# EasyEDA Pro project TargetV1.eprj

# Schematic Schematic1
Create Date: 2022-10-10; Page Name: P1; Project Name: TargetV1; Schematic Name: Schematic1; Update Date: 2023-03-28
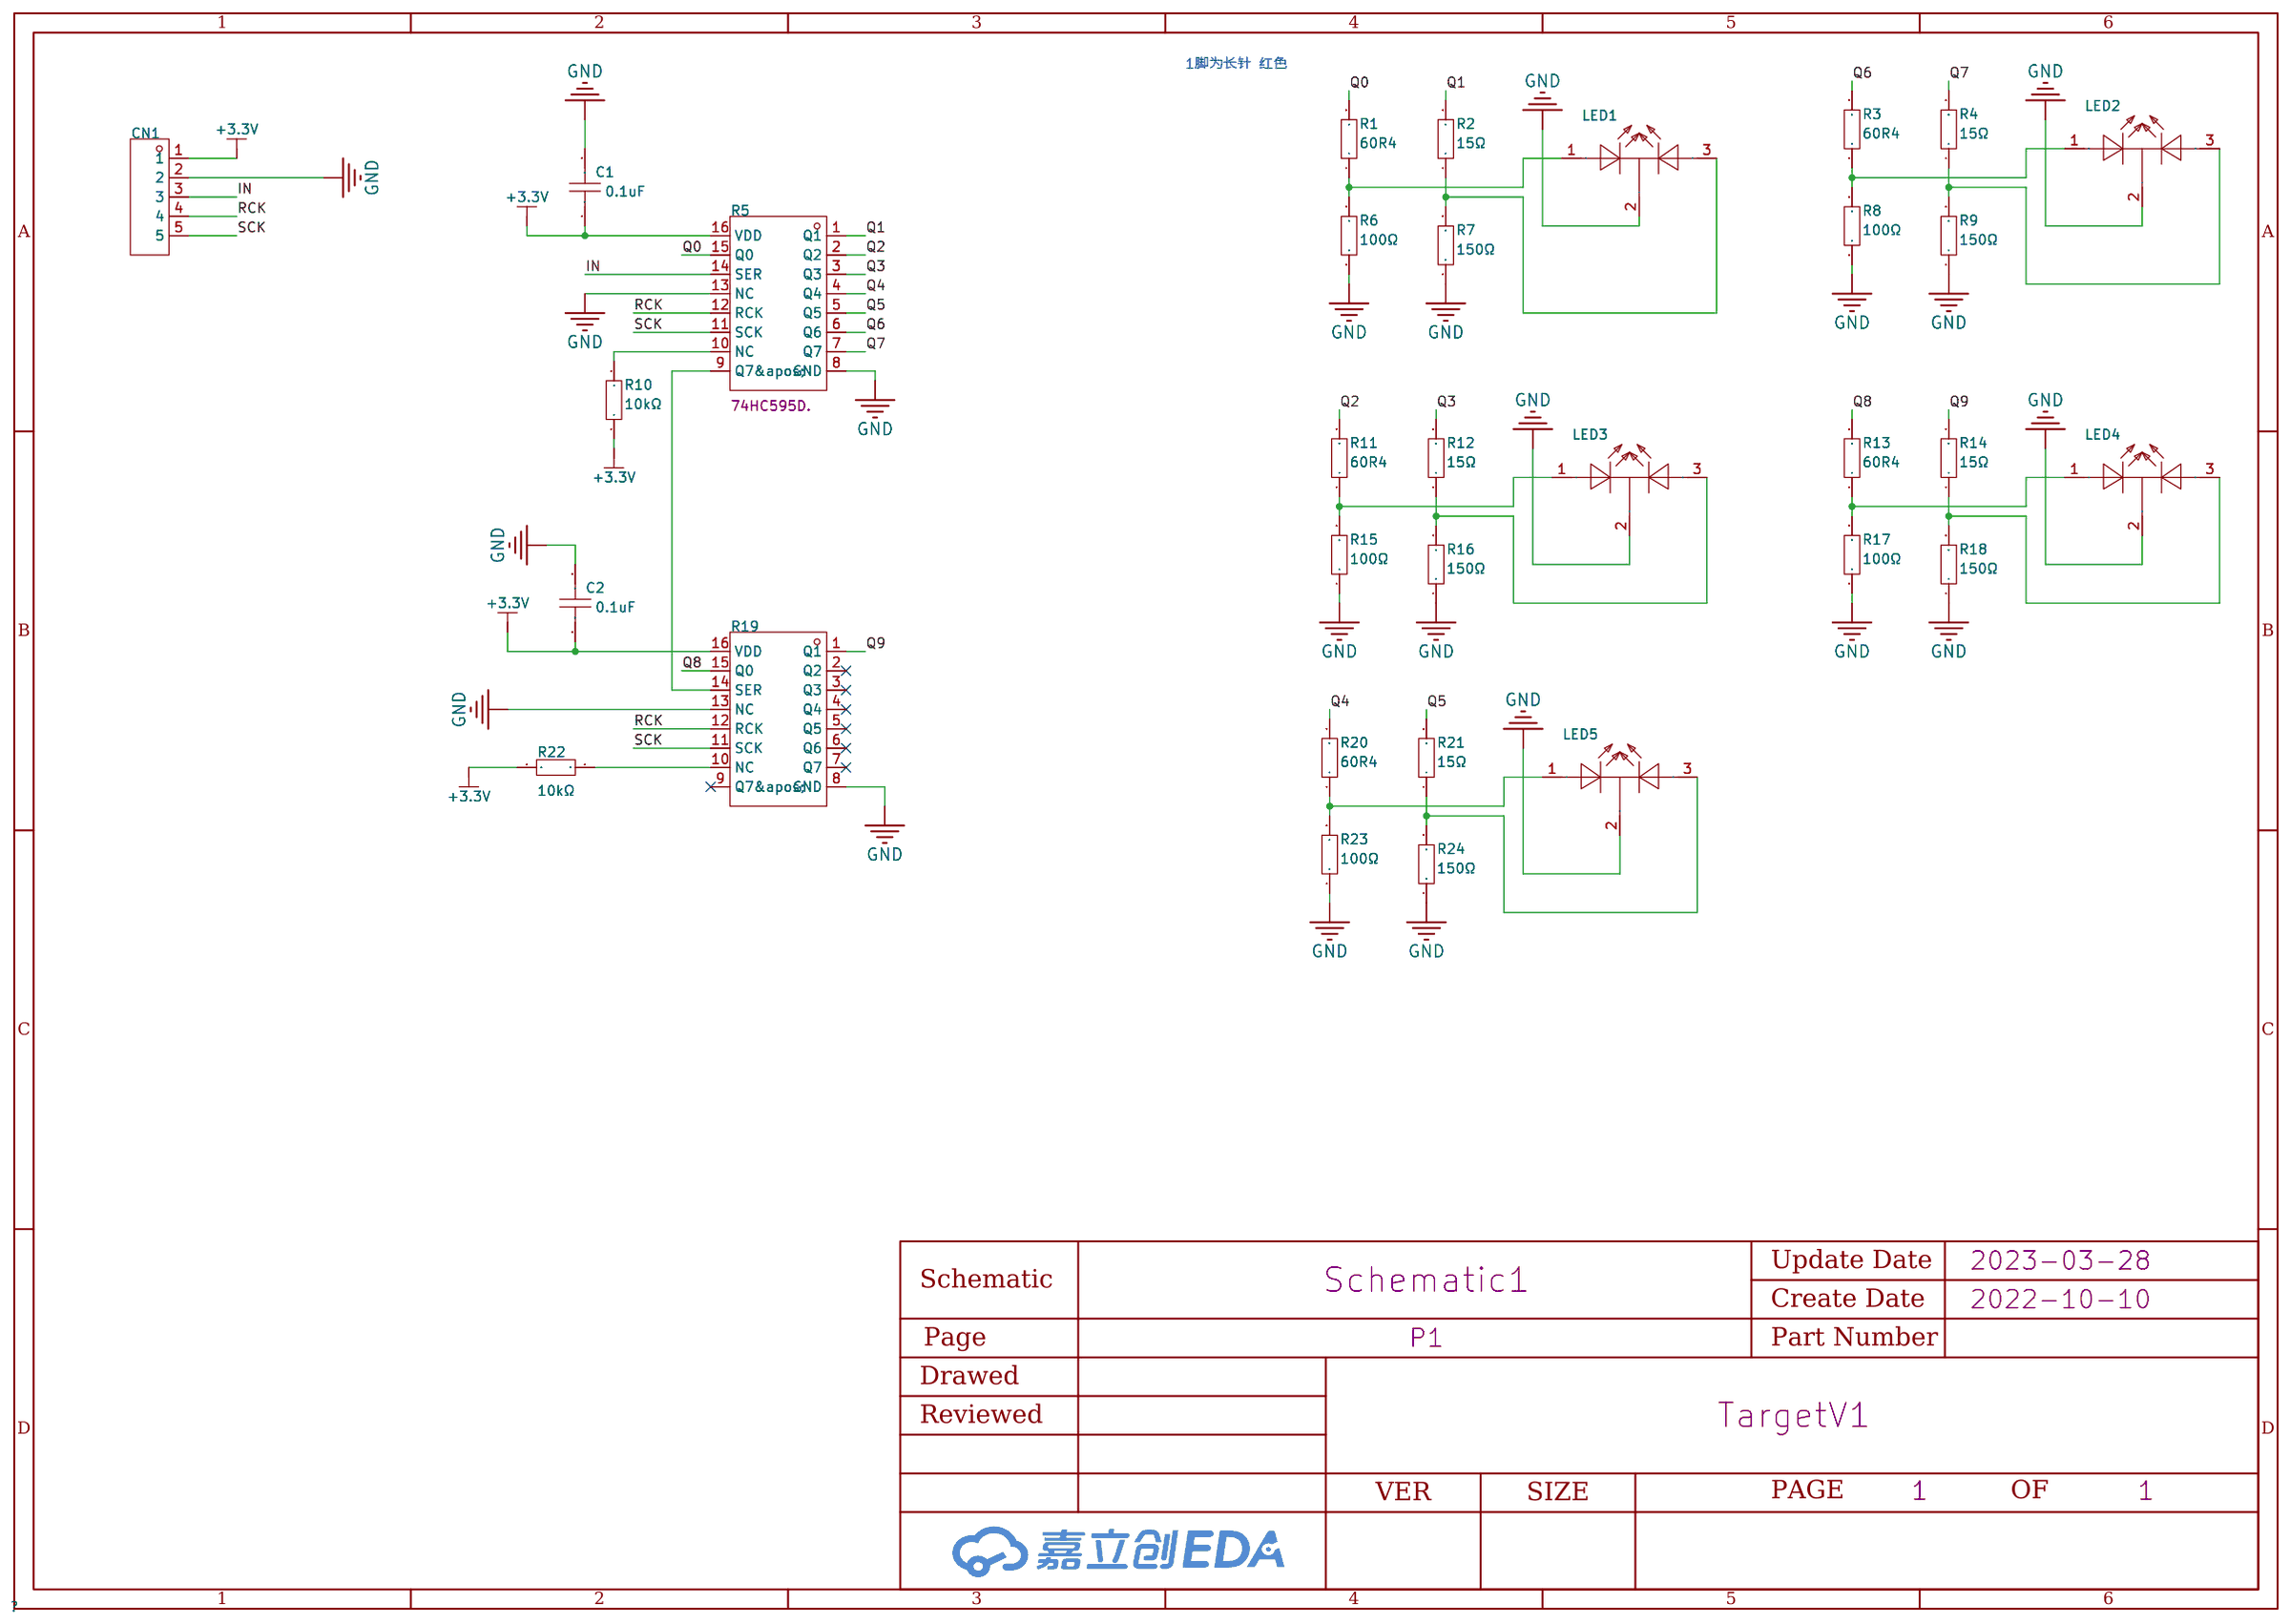
[diagram p0: schematic sheet]

## Parts
C1  0.1uF  [C0603]
C2  0.1uF  [C0603]
CN1  HX25003-5A  [CONN-TH_5P-P2.50_HX25003-5A]
LED1  MHLC5019UEGTD  [LED-TH_3P-BD5.9-P2.54-BI]
LED2  MHLC5019UEGTD  [LED-TH_3P-BD5.9-P2.54-BI]
LED3  MHLC5019UEGTD  [LED-TH_3P-BD5.9-P2.54-BI]
LED4  MHLC5019UEGTD  [LED-TH_3P-BD5.9-P2.54-BI]
LED5  MHLC5019UEGTD  [LED-TH_3P-BD5.9-P2.54-BI]
R1  60R4  [R0603]
R2  15Ω  [R0603]
R3  60R4  [R0603]
R4  15Ω  [R0603]
R5  74HC595D.  [SOP-16_L9.9-W3.9-P1.27-LS6.0-BL]
R6  100Ω  [R0603]
R7  150Ω  [R0603]
R8  100Ω  [R0603]
R9  150Ω  [R0603]
R10  10kΩ  [R0603]
R11  60R4  [R0603]
R12  15Ω  [R0603]
R13  60R4  [R0603]
R14  15Ω  [R0603]
R15  100Ω  [R0603]
R16  150Ω  [R0603]
R17  100Ω  [R0603]
R18  150Ω  [R0603]
R19  74HC595D.  [SOP-16_L9.9-W3.9-P1.27-LS6.0-BL]
R20  60R4  [R0603]
R21  15Ω  [R0603]
R22  10kΩ  [R0603]
R23  100Ω  [R0603]
R24  150Ω  [R0603]

## Library data of the parts
C1 C2 = CC0603KRX7R9BB104: 容值:100nF;精度:±10%;额定电压:50V;材质(温度系数):X7R;; LCSC Part Name: 100nF ±10% 50V; Supplier Part: C14663; Manufacturer: YAGEO(国巨); Supplier Footprint: 0603; JLCPCB Part Class: Basic Part; Datasheet: https://atta.szlcsc.com/upload/public/pdf/source/20170116/1484561234239.pdf; Supplier: LCSC; Tolerance: ±10%; Voltage Rated: 50V; Temperature Coefficient: X7R
CN1 = HX25003-5A: 参考系列:XH;间距:2.5mm;插针结构:1x5P;排数:1;每排PIN数:5;行距:-;公母:公型插针;安装方式:直插;额定电流:-;工作温度范围:-;; LCSC Part Name: XH 2.5mm 1x5P 直插; Supplier Part: C442302; Manufacturer: HX(红星); Supplier Footprint: 插件,P=2.5mm; JLCPCB Part Class: Extended Part; Datasheet: https://atta.szlcsc.com/upload/public/pdf/source/20191028/C442302_E66AD84792E19526D7353D56EEE1C29F.pdf; Supplier: LCSC; Reference Series: XH; Pitch: 2.5mm; Pins Structure: 1x5P; Number of Rows: 1; Number of PINs Per Row: 5; Gender: 公型插针; Mounting Style: 直插
LED1-LED5 = MHLC5019UEGTD: 发光颜色:红灯,翠绿;二极管配置:共阴极;透镜颜色:雾状白;主波长:525nm；622nm;峰值波长:530nm；632nm;色温:-;测试电流:20mA;功率:80mW；120mW;发光角度:120°;安装方式:-;工作温度:-25~+85;; LCSC Part Name: 红灯,翠绿 共阴极 525nm 622nm; Supplier Part: C473816; Manufacturer: MEIHUA(美华); Supplier Footprint: 直插,P=2.54mm; JLCPCB Part Class: Extended Part; Datasheet: https://atta.szlcsc.com/upload/public/pdf/source/20191226/C473816_FEA15EBA9D37F3DD249283AD8272677B.pdf; Supplier: LCSC; Emitted Color: 红灯,翠绿; Diode Configuration: 共阴极; Lens Color: 雾状白; Dominant Wavelength: 525nm；622nm; Peak Wavelength: 530nm；632nm; Forward Current: 20mA; Power Dissipation: 80mW；120mW; Viewing Angle: 120°; Operating Temperature: -25~+85; Lamp Holder Type: 5mm圆形灯头
R1-R4 R6-R18 R20-R24 = 0603WAF1002T5E: 电阻类型:厚膜电阻;阻值:10kΩ;精度:±1%;功率:100mW;温度系数:±100ppm/;最大工作电压:75V;工作温度范围:-55~+155;; LCSC Part Name: 10kΩ ±1% 100mW; Supplier Part: C25804; Manufacturer: UNI-ROYAL(厚声); Supplier Footprint: 0603; JLCPCB Part Class: Basic Part; Datasheet: https://atta.szlcsc.com/upload/public/pdf/source/20200306/C422600_1E6D84923E4A46A82E41ADD87F860B5C.pdf; Supplier: LCSC; Type: 厚膜电阻; Tolerance: ±1%; Power(Watts): 100mW; Temperature Coefficient: ±100ppm/; Overload Voltage (Max): 75V; Operating Temperature Range: -55~+155
R5 R19 = 74HC595D.: Supplier Part: C2929943; Manufacturer: FM(富满); Supplier Footprint: SOP-16; JLCPCB Part Class: Extended Part; Datasheet: https://atta.szlcsc.com/upload/public/pdf/source/20211125/20F1E3849D7C8A7DB346B0C433D530E9.pdf; Supplier: LCSC

## Nets
+3.3V: C1.1 C2.1 CN1.1 R5.16(VDD) R10.1 R19.16(VDD) R22.2
GND: C1.2 C2.2 CN1.2 LED1.2(-) LED2.2(-) LED3.2(-) LED4.2(-) LED5.2(-) R5.8(GND) R5.13(NC) R6.1 R7.1 R8.1 R9.1 R15.1 R16.1 R17.1 R18.1 R19.8(GND) R19.13(NC) R23.1 R24.1
IN: CN1.3 R5.14(SER)
Q0: R1.2 R5.15(Q0)
Q1: R2.2 R5.1(Q1)
Q2: R5.2(Q2) R11.2
Q3: R5.3(Q3) R12.2
Q4: R5.4(Q4) R20.2
Q5: R5.5(Q5) R21.2
Q6: R3.2 R5.6(Q6)
Q7: R4.2 R5.7(Q7)
Q8: R13.2 R19.15(Q0)
Q9: R14.2 R19.1(Q1)
RCK: CN1.4 R5.12(RCK) R19.12(RCK)
SCK: CN1.5 R5.11(SCK) R19.11(SCK)
$1N1102: R5.10(NC) R10.2
$1N1166: R5.9(Q7&apos;) R19.14(SER)
$1N1771: R19.10(NC) R22.1
$1N5350: LED1.1(+) R1.1 R6.2
$1N5516: LED1.3(+) R2.1 R7.2
$1N6308: LED3.1(+) R11.1 R15.2
$1N6309: LED3.3(+) R12.1 R16.2
$1N6730: LED5.1(+) R20.1 R23.2
$1N6731: LED5.3(+) R21.1 R24.2
$1N7312: LED2.1(+) R3.1 R8.2
$1N7313: LED2.3(+) R4.1 R9.2
$1N7752: LED4.1(+) R13.1 R17.2
$1N7753: LED4.3(+) R14.1 R18.2

Not connected (* = marked no-connect by the designer): R19 2(Q2)* 3(Q3)* 4(Q4)* 5(Q5)* 6(Q6)* 7(Q7)* 9(Q7&apos;)*

## Notes on the sheet
- 1脚为长针 红色

# Board PCB3
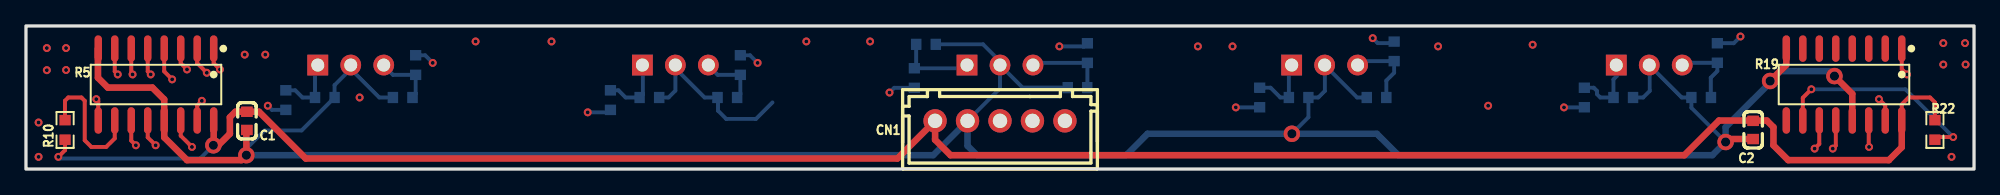
[diagram p1: board, top side]
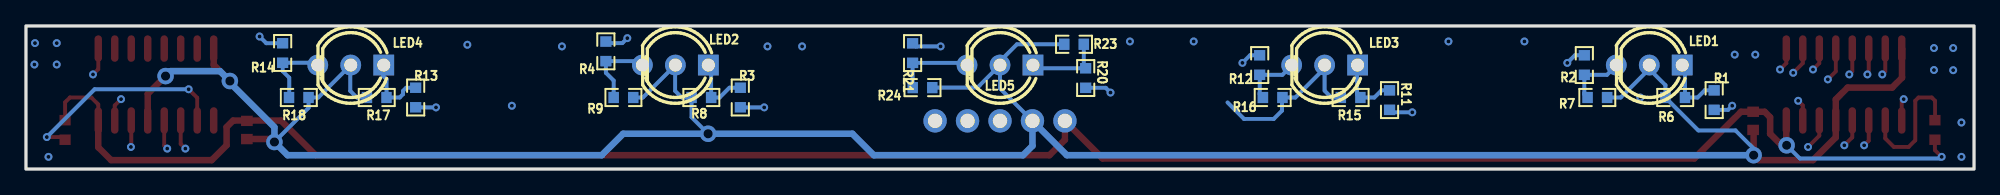
[diagram p2: board, bottom side, seen from below]

Outline 150.02 x 11.02 mm; copper layers: Top Layer, CPU1, CPU2, Bottom Layer. Coordinates in mm from the lower left corner of the outline.
Outline path: rectangle 0,11.02 150.02,0
Stack: Top Layer 0.035mm / Dielectric1 0.48mm PP er 4.5 / CPU1 0.035mm / Dielectric2 0.48mm FR4 er 4.5 / CPU2 0.035mm / Dielectric3 0.48mm PP er 4.5 / Bottom Layer 0.035mm

## Design rules (mm)
spacing safeClearance (default): track to track 0.152, other pairs 0.152 to 0.3
track width trackWidth (default): min 0.127, default 0.254, max 2.54
differential pair differentialPair (default): width min 0.127, default 0.254, max 2.54; gap min 0.152, default 0.152
via viaSize (default): diameter min 0.5, default 0.61, max 10; hole min 0.3, default 0.305, max 6

## Placement (name value [footprint] x y rotation side)
C1  0.1uF  [C0603]  17.01 3.71 270 top
C2  0.1uF  [C0603]  133.01 3.01 270 top
CN1  HX25003-5A  [CONN-TH_5P-P2.50_HX25003-5A]  75.01 3.71 0 top
LED1  MHLC5019UEGTD  [LED-TH_3P-BD5.9-P2.54-BI]  25.01 8.01 0 bottom
LED2  MHLC5019UEGTD  [LED-TH_3P-BD5.9-P2.54-BI]  100.01 8.01 0 bottom
LED3  MHLC5019UEGTD  [LED-TH_3P-BD5.9-P2.54-BI]  50.01 8.01 0 bottom
LED4  MHLC5019UEGTD  [LED-TH_3P-BD5.9-P2.54-BI]  125.01 8.01 0 bottom
LED5  MHLC5019UEGTD  [LED-TH_3P-BD5.9-P2.54-BI]  75.01 8.01 0 bottom
R1  60R4  [R0603]  20.01 5.31 270 bottom
R2  15Ω  [R0603]  30.01 8.01 90 bottom
R3  60R4  [R0603]  95.01 5.51 270 bottom
R4  15Ω  [R0603]  105.37 9.07 90 bottom
R5  74HC595D.  [SOP-16_L9.9-W3.9-P1.27-LS6.0-BL]  10.01 6.51 180 top
R6  100Ω  [R0603]  23.01 5.51 180 bottom
R7  150Ω  [R0603]  29.01 5.51 0 bottom
R8  100Ω  [R0603]  98.01 5.51 180 bottom
R9  150Ω  [R0603]  104.01 5.51 0 bottom
R10  10kΩ  [R0603]  3.01 3.01 90 top
R11  60R4  [R0603]  45.01 5.31 270 bottom
R12  15Ω  [R0603]  55.01 8.01 90 bottom
R13  60R4  [R0603]  120.01 5.51 270 bottom
R14  15Ω  [R0603]  130.26 8.94 90 bottom
R15  100Ω  [R0603]  48.01 5.51 180 bottom
R16  150Ω  [R0603]  54.01 5.51 0 bottom
R17  100Ω  [R0603]  123.01 5.51 180 bottom
R18  150Ω  [R0603]  129.01 5.51 0 bottom
R19  74HC595D.  [SOP-16_L9.9-W3.9-P1.27-LS6.0-BL]  140.01 6.51 180 top
R20  60R4  [R0603]  68.41 7.01 270 bottom
R21  15Ω  [R0603]  81.74 8.93 90 bottom
R22  10kΩ  [R0603]  147.01 3.01 90 top
R23  100Ω  [R0603]  69.31 9.61 180 bottom
R24  150Ω  [R0603]  80.98 6.27 0 bottom

## Footprints (pads in the part's own frame, mm; a bottom-side part is the same pattern mirrored in y, then rotated)
C0603
  rect 0.8x0.9 smd: 1(-0.7,0) 2(0.7,0)
CONN-TH_5P-P2.50_HX25003-5A
  round 1.8 hole 1.1: 1(-5,0) 2(-2.5,0) 3(0,0) 4(2.5,0) 5(5,0)
LED-TH_3P-BD5.9-P2.54-BI
  rect 1.6x1.6 hole 1: 1(-2.54,0)
  round 1.6 hole 1: 2(0,0) 3(2.54,0)
R0603
  rect 0.806x0.864 smd: 1(-0.753,0) 2(0.753,0)
SOP-16_L9.9-W3.9-P1.27-LS6.0-BL
  oval 0.574x2.038 smd: 1(-4.445,-2.769) 2(-3.175,-2.769) 3(-1.905,-2.769) 4(-0.635,-2.769) 5(0.635,-2.769) 6(1.905,-2.769) 7(3.175,-2.769) 8(4.445,-2.769) 9(4.445,2.769) 10(3.175,2.769) 11(1.905,2.769) 12(0.635,2.769) 13(-0.635,2.769) 14(-1.905,2.769) 15(-3.175,2.769) 16(-4.445,2.769)

## Nets
As in the schematic.

Pads without a net: R19 2 3 4 5 6 7 9

## Via types
v1: diameter 0.61, hole 0.305, Top Layer to Bottom Layer, 53 vias
v2: diameter 1.27, hole 0.711, Top Layer to Bottom Layer, 5 vias
v3: diameter 1.27, hole 0.7, Top Layer to Bottom Layer, 1 via

## Routing (per net, layer and track width the routed paths; a pad name or vN(x,y) marks a point on that pad's centre or on a via; arc(x,y) is an arc through that point)
+3.3V: length 163.6
  Top Layer w0.3: v1(2.5,0.94) 3.01,1.46 R10.1 ; R19.16 144.46,4.98 144.99,5.51 146.64,5.51 147.01,5.14 R22.2
  Top Layer w0.5: R5.16 14.46,1.85 v3(14.43,1.83) 14.81,1.83 15.7,2.72 15.7,3.99 16.13,4.41 C1.1 17.95,4.41 21.55,0.81 67.11,0.81 CN1.1 70.01,2.26 71.2,1.07 127.72,1.07 130.38,3.73 132.99,3.73 C2.1 133.03,3.73 134.07,3.73 134.57,3.23 134.57,1.83 135.72,0.69 143.47,0.69 144.46,1.68 R19.16
  Bottom Layer w0.3: v1(2.5,0.94) 2.62,0.81 13.42,0.81 v3(14.43,1.83)
GND: length 230
  Top Layer w0.5: R19.13 140.65,5.79 v2(139.27,7.16) ; C1.2 16.97,2.97 v2(16.97,1.07) 16.59,0.69 12.4,0.69 10.65,2.44 R5.13 10.65,5.36 9.73,6.27 6.31,6.27 5.54,7.04 5.54,9.26 R5.8 ; R19.8 135.57,8.03 v2(134.32,6.78) ; v2(130.89,2.08) 131.12,2.31 C2.2
  Bottom Layer w0.3: 100.03,7.99 100.03,6.02 99.52,5.51 R8.1 98.77,3.99 v2(97.49,2.72) ; 100.03,7.99 LED2.2 ; 100.03,7.99 102.51,5.51 R9.1 ; R7.1 27.21,5.51 25.01,7.71 ; 50.01,7.76 50.01,6.04 49.48,5.51 R15.1 ; 50.01,7.76 52.26,5.51 R16.1 53.29,5.48 53.29,4.5 53.93,3.86 56.22,3.86 57.49,5.13 ; 50.01,7.76 LED3.2 ; LED5.2 76.75,6.27 R24.1 ; LED5.2 75.01,6.21 CN1.2 ; LED5.2 75.01,8.31 73.71,9.61 R23.1 ; 125.05,7.97 127.51,5.51 R18.1 128.26,4.72 v2(130.89,2.08) ; 125.05,7.97 LED4.2 ; 125.05,7.97 125.05,6.02 124.54,5.51 R17.1 ; 25.01,7.71 LED1.2 ; 25.01,7.71 23.77,6.46 R6.1 21.23,2.97 18.37,2.97 16.97,1.58 v2(16.97,1.07)
  Bottom Layer w0.5: v2(139.27,7.16) 138.89,7.54 135.08,7.54 v2(134.32,6.78) 134.32,6.66 130.89,3.23 v2(130.89,2.08) 129.88,1.07 105.68,1.07 104.03,2.72 v2(97.49,2.72) 86.38,2.72 84.73,1.07 73.23,1.07 72.51,1.79 CN1.2 69.87,1.07 v2(16.97,1.07)
  vias: v1(0.97,3.59) v1(0.97,0.94) v1(1.61,9.32) v1(1.61,7.62) v1(3.09,9.32) v1(3.09,7.63) v1(16.85,8.81) v1(18.43,8.81) v1(25.7,5.51) v1(34.63,9.83) v1(40.47,9.83) v1(60.1,9.83) v1(65.01,9.83) v1(90.25,9.45) v1(92.92,9.45) v1(108.75,9.45) v1(112.6,4.88) v1(116.03,9.58) v1(147.66,9.7) v1(147.66,8.05) v1(148.29,0.94) v1(149.33,9.7) v1(149.37,8.05)
IN: length 68
  Top Layer w0.3: R5.14 11.92,2.57 v1(12.78,1.7)
  CPU1 w0.3: CN1.3 75.01,2.46 74.38,1.83 23.58,1.83 21.42,3.99 15.07,3.99 v1(12.78,1.7)
Q0: length 8.4
  Top Layer w0.3: v1(13.54,5.26) 13.19,4.9 R5.15
  CPU1 w0.3: v1(18.62,4.88) 18.24,5.26 v1(13.54,5.26)
  Bottom Layer w0.3: v1(18.62,4.88) 18.94,4.56 R1.2
Q1: length 21.1
  Top Layer w0.3: v1(14.94,7.67) 14.46,8.16 R5.1
  CPU1 w0.3: v1(14.94,7.67) 19.51,7.67 21.42,9.58 29.93,9.58 v1(31.32,8.18)
  Bottom Layer w0.3: v1(31.32,8.18) 30.74,8.77 R2.2
Q2: length 34.6
  Top Layer w0.3: v1(13.92,7.42) 13.19,8.16 R5.2
  CPU1 w0.3: v1(43.26,4.37) 23.83,4.37 21.16,7.04 14.31,7.04 v1(13.92,7.42)
  Bottom Layer w0.3: R11.2 44.82,4.37 v1(43.26,4.37)
Q3: length 52.8
  Top Layer w0.3: R5.3 11.92,8.16 v1(12.4,7.67)
  CPU1 w0.3: v1(56.34,8.18) 54.95,9.58 45.93,9.58 41.48,5.13 35.52,5.13 30.56,10.08 14.81,10.08 v1(12.4,7.67)
  Bottom Layer w0.3: R12.2 55.76,8.77 v1(56.34,8.18)
Q4: length 62.2
  Top Layer w0.3: v1(11.26,6.91) 10.65,7.52 R5.4
  CPU1 w0.3: v1(11.26,6.91) 11.64,6.53 20.78,6.53 23.7,3.61 64.22,3.61 v1(66.5,5.89)
  Bottom Layer w0.3: v1(66.5,5.89) 66.87,6.26 R20.2
Q5: length 83.2
  Top Layer w0.3: R5.5 9.38,7.52 v1(9.61,7.29)
  CPU2 w0.3: v1(79.58,9.45) 68.79,9.45 64.22,4.88 60.66,4.88 55.96,9.58 46.18,9.58 41.48,4.88 35.77,4.88 30.82,9.83 12.15,9.83 v1(9.61,7.29)
  Bottom Layer w0.3: R21.2 81.51,9.45 v1(79.58,9.45)
Q6: length 92.4
  Top Layer w0.3: R5.6 8.11,7.39 v1(8.21,7.29)
  CPU1 w0.3: v1(8.21,7.29) 9.48,6.02 20.4,6.02 23.58,2.84 64.98,2.84 68.03,5.89 84.66,5.89 85.81,4.75 v1(93.17,4.75)
  Bottom Layer w0.3: v1(93.17,4.75) 95,4.75 R3.2
Q7: length 113.6
  Top Layer w0.3: v1(7.07,7.29) 6.84,7.52 R5.7
  CPU2 w0.3: v1(103.71,10.08) 97.11,10.08 92.41,5.39 85.93,5.39 81.11,10.21 68.79,10.21 64.09,5.51 60.91,5.51 56.22,10.21 45.55,10.21 40.85,5.51 35.9,5.51 31.07,10.34 10.11,10.34 v1(7.07,7.29)
  Bottom Layer w0.3: R4.2 105.25,9.7 104.09,9.7 v1(103.71,10.08)
Q8: length 27.9
  Top Layer w0.3: R19.15 143.19,4.9 v1(142.7,5.39)
  CPU1 w0.3: v1(118.45,4.75) 119.08,5.39 v1(142.7,5.39)
  Bottom Layer w0.3: v1(118.45,4.75) 120,4.75 R13.2
Q9: length 18.2
  Top Layer w0.3: R19.1 144.46,7.7 v1(144.86,7.29)
  CPU1 w0.3: v1(132.03,10.21) 141.94,10.21 v1(144.86,7.29)
  Bottom Layer w0.3: v1(132.03,10.21) 131.52,9.69 R14.2
RCK: length 141.2
  Top Layer w0.3: v1(139.15,1.58) 139.38,1.81 R19.12 ; v1(9.99,1.83) 9.38,2.44 R5.12
  CPU2 w0.3: v1(9.99,1.83) 12.27,4.11 41.86,4.11 43.26,2.72 65.36,2.72 68.79,6.15 75.08,6.15 CN1.4 ; CN1.4 77.51,4.96 78.44,5.89 81.24,5.89 83.39,3.73 136.99,3.73 v1(139.15,1.58) ; CN1.4 77.51,3.55 ; 77.55,3.55 77.51,3.51
SCK: length 138.3
  Top Layer w0.3: v1(137.75,1.58) 138.11,1.93 R19.11 ; v1(8.46,1.83) 8.11,2.19 R5.11
  CPU1 w0.3: v1(137.75,1.58) 135.34,1.58 133.18,3.73 80.03,3.73 CN1.5
  CPU2 w0.3: CN1.5 80.01,2.38 79.33,1.7 43.39,1.7 41.48,3.61 13.42,3.61 10.88,1.07 9.23,1.07 v1(8.46,1.83)
$1N1102: length 10.5
  Top Layer w0.3: R5.10 6.84,2.36 6.18,1.7 5.03,1.7 4.53,2.21 4.53,5.26 4.27,5.51 3.26,5.51 3,5.26 3,3.77 R10.2
$1N1166: length 147.2
  Top Layer w0.3: R5.9 5.57,5.23 v1(5.42,5.39) ; R19.14 141.92,1.73 v1(141.94,1.7)
  CPU2 w0.3: v1(5.42,5.39) 5.42,3.61 8.46,0.56 14.81,0.56 16.59,2.34 41.48,2.34 42.88,0.94 127.08,0.94 129.37,3.23 134.57,3.23 137.12,0.69 141.18,0.69 141.94,1.45 v1(141.94,1.7)
$1N1771: length 16.6
  Top Layer w0.3: R19.10 136.84,5.49 v1(137.5,6.15) ; v1(148.42,2.46) 147.22,2.46 R22.1
  Bottom Layer w0.3: v1(148.42,2.46) 144.74,6.15 v1(137.5,6.15)
$1N5350: length 5.1
  Bottom Layer w0.3: 22.51,8.01 22.26,7.76 R6.2 21.29,5.51 20.74,6.07 R1.1
$1N5516: length 4.7
  Bottom Layer w0.3: R7.2 30.01,5.76 R2.1 28.27,7.26 27.51,8.01
$1N6308: length 5.1
  Bottom Layer w0.3: R11.1 45.63,6.07 46.18,5.51 R15.2 47.51,5.77 47.51,8.01
$1N6309: length 4.7
  Bottom Layer w0.3: 52.51,8.01 53.27,7.26 R12.1 55.01,5.76 R16.2
$1N6730: length 6.1
  Bottom Layer w0.3: 72.51,8.01 72.27,7.77 R20.1 68.56,7.91 R23.2
$1N6731: length 6.2
  Bottom Layer w0.3: 77.51,8.01 77.68,8.18 R21.1 81.74,6.28 R24.2
$1N7312: length 5.2
  Bottom Layer w0.3: R3.1 95.85,6.27 96.6,5.51 R8.2 97.26,7.76 97.51,8.01
$1N7313: length 6
  Bottom Layer w0.3: R9.2 104.77,6.82 105.37,7.42 R4.1 102.81,8.31 102.51,8.01
$1N7752: length 5.3
  Bottom Layer w0.3: R13.1 120.74,6.27 120.99,6.02 120.99,5.77 121.24,5.51 R17.2 122.26,5.51 122.26,6.91 122.51,7.17 122.51,8.01
$1N7753: length 5.7
  Bottom Layer w0.3: R18.2 129.75,5.53 129.75,7.04 130.26,7.54 R14.1 127.69,8.19 127.51,8.01

## Copper pours and planes (outline as drawn; the poured copper is in the pictures)
GND on Top Layer: 0,11.02 150.02,11.02 150.02,0 0,0
GND on Bottom Layer: 0,11.02 150.02,11.02 150.02,0 0,0
